# Altium schematic sheet AirBee.SchDoc
size A4
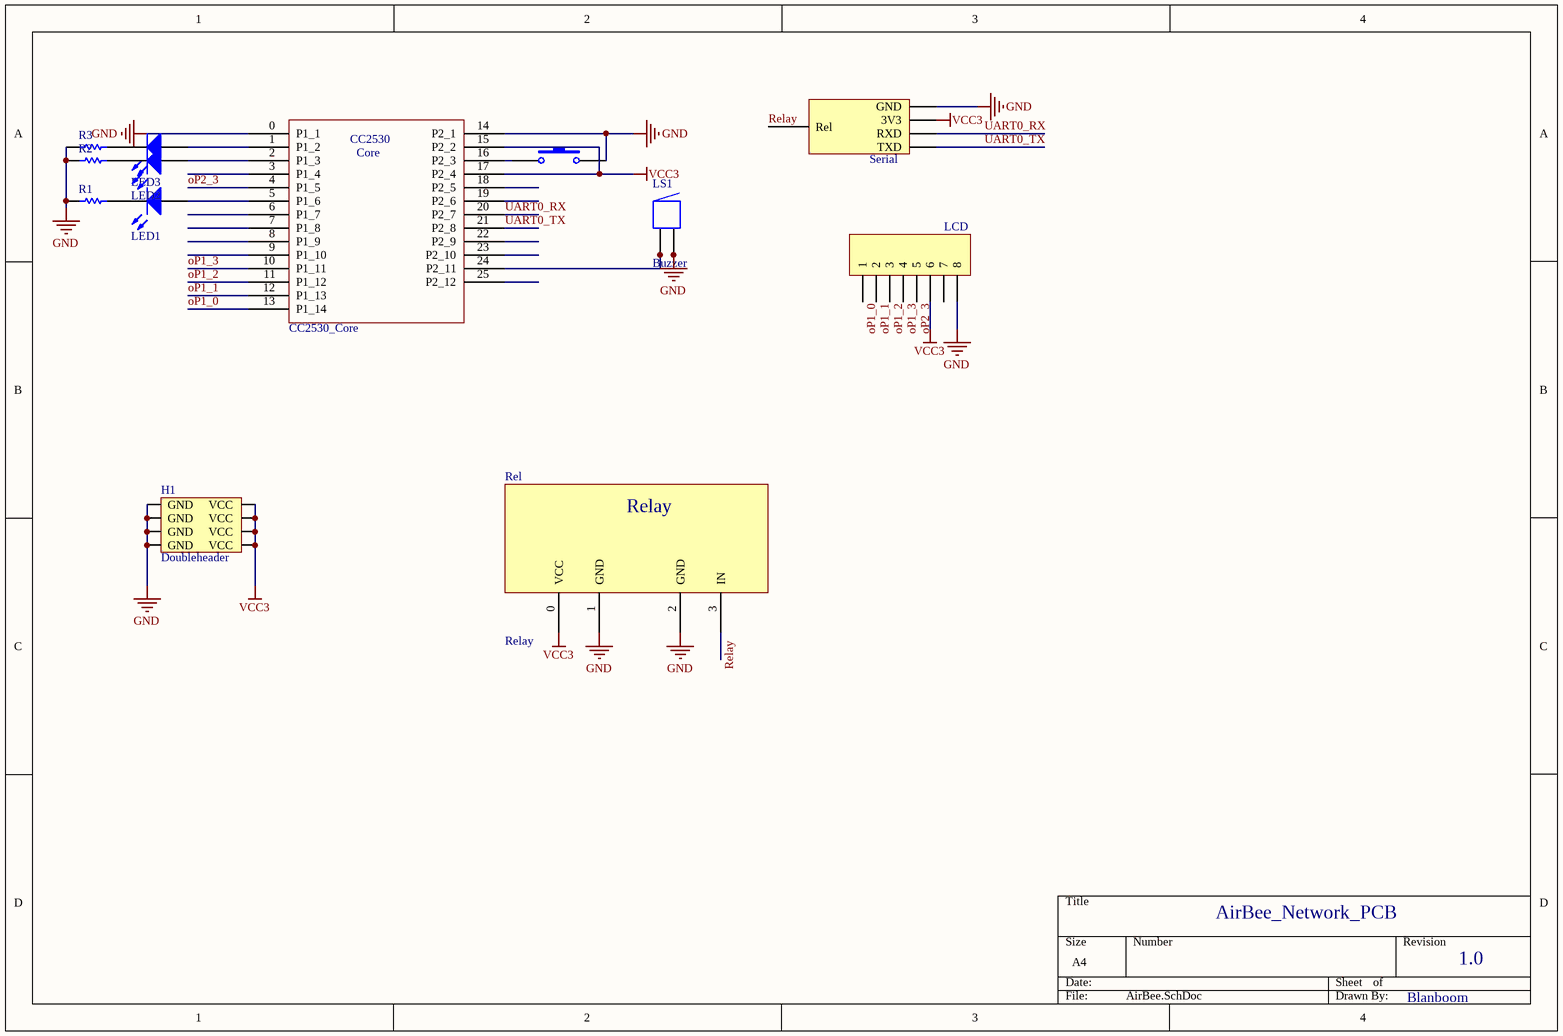
[diagram p0: AirBee.SchDoc]

## Parts
2530  CC2530_Core  [CC2530_Core]
D1  LED1  [LED]
D2  LED2  [LED]
D3  LED3  [LED]
H1  Doubleheader  [header16]
LCD  HEAder8  [header8]  (value not drawn)
LS1  Buzzer  [5V-BUZZER]
R1  Res  [AXIAL-0.3]  (value not drawn)
R2  Res  [AXIAL-0.3]  (value not drawn)
R3  Res  [AXIAL-0.3]  (value not drawn)
Rel  Relay  [Relay]
Reset  Switch  [微动开关]  (value not drawn)
Serial  Serial  [header5]  (value not drawn)

## Nets
GND: 2530.0(P1_1) 2530.14(P2_1) H1.1(GND) H1.2(GND) H1.3(GND) H1.4(GND) LCD.8 LS1.2 LS1.2A R1.1 R2.1 R3.1 Rel.1(GND) Rel.2(GND) Reset.2 Serial.4(GND)
VCC3: 2530.15(P2_2) 2530.17(P2_4) H1.5(VCC) H1.6(VCC) H1.7(VCC) H1.8(VCC) LCD.6 Rel.0(VCC) Serial.3(3V3)
oP1_0: 2530.13(P1_14) LCD.1
oP1_1: 2530.12(P1_13) LCD.2
oP1_2: 2530.11(P1_12) LCD.3
oP1_3: 2530.10(P1_11) LCD.4
oP2_3: 2530.4(P1_5) LCD.5
Relay: Rel.3(IN) Serial.5(Rel)
UART0_RX: 2530.20(P2_7) Serial.2(RXD)
UART0_TX: 2530.21(P2_8) Serial.1(TXD)
Net2530_1: 2530.1(P1_2) D3.1(A)
Net2530_2: 2530.2(P1_3) D2.1(A)
Net2530_5: 2530.5(P1_6) D1.1(A)
Net2530_16: 2530.16(P2_3) Reset.1
Net2530_24: 2530.24(P2_11) LS1.1 LS1.1A
NetD1_2: D1.2(K) R1.2
NetD2_2: D2.2(K) R2.2
NetD3_2: D3.2(K) R3.2

Not connected (* = marked no-connect by the designer): 2530 3(P1_4) 6(P1_7) 7(P1_8) 8(P1_9) 9(P1_10) 18(P2_5) 19(P2_6) 22(P2_9) 23(P2_10) 25(P2_12); LCD 7

## Notes on the sheet
- AirBee_Network_PCB
- 1.0
- Blanboom
- (in symbol CC2530_Core) CC2530; Core

## Library data of the parts
D1-D3 = LED0: Typical INFRARED GaAs LED; Published: 8-Jun-2000; LatestRevisionDate: 08-Jul-2005; LatestRevisionNote: Mech Layer 1 removed.; PackageReference: LED-0; Publisher: Altium Limited
LS1 = Buzzer: Magnetic Transducer Buzzer; Published: 24-Mar-1999; LatestRevisionDate: 17-Dec-2003; LatestRevisionNote: Schematic revised, PCB Footprint replaced.; DatasheetDocument: 17-Dec-2003; PackageReference: ABSM-1574; Publisher: Altium Limited; ComponentLink1Description: Manufacturer Link; ComponentLink1URL: http://www.megastar.com/linecard/buzzmode/index.php
R1-R3 = Res1: Resistor; Value: 1K; Published: 8-Jun-2000; LatestRevisionDate: 17-Jul-2002; LatestRevisionNote: Re-released for DXP Platform.; PackageReference: AXIAL-0.3; Publisher: Altium Limited
Rel = Relay: pin to pad: 0>1 1>2 2>3 3>4